# Altium schematic sheet FRAM_memory.SchDoc
size A4; Organization: Creotech Instruments; Address1: Gen. L. Okulickiego 7/9; Address2: 05-500 Piaseczno; Address3: Poland
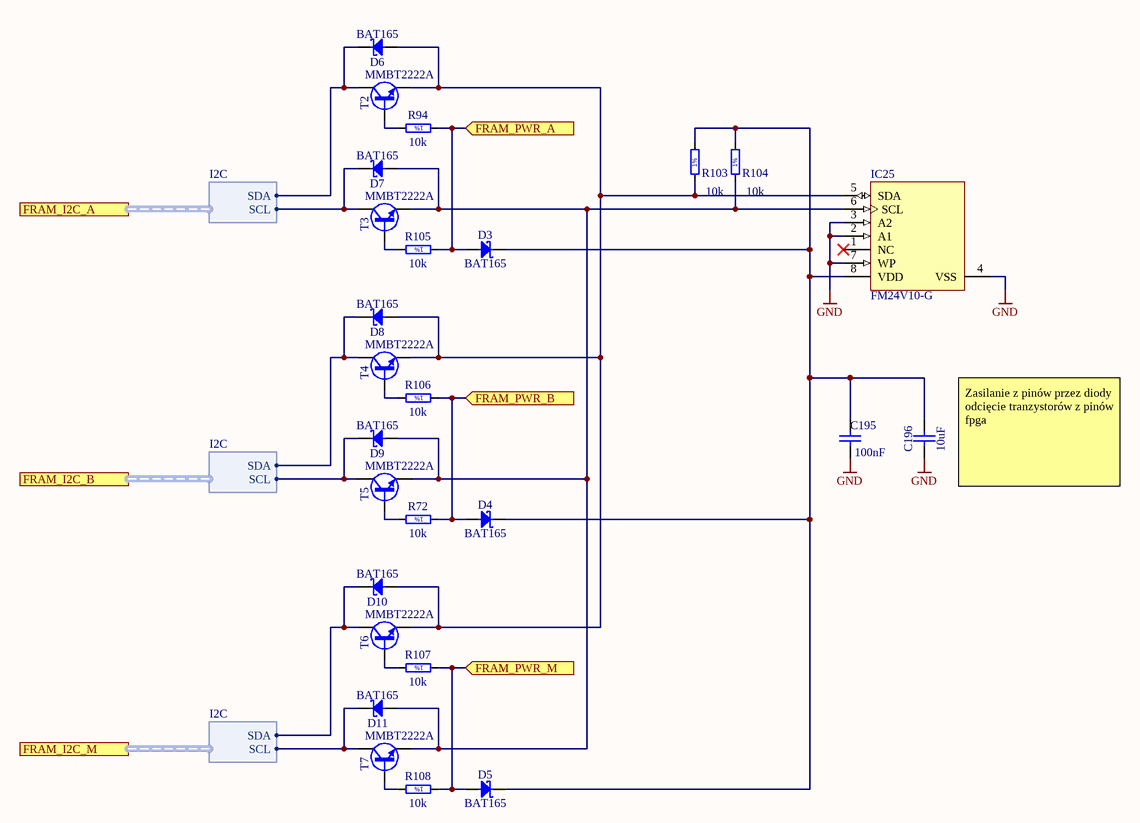
[diagram p0: FRAM_memory.SchDoc]

## Parts
C195  100nF  [CAPC1608X87N]
C196  10uF  [CAPC1608X80N]
D3  BAT165  [SOD2512X110N]
D4  BAT165  [SOD2512X110N]
D5  BAT165  [SOD2512X110N]
D6  BAT165  [SOD2512X110N]
D7  BAT165  [SOD2512X110N]
D8  BAT165  [SOD2512X110N]
D9  BAT165  [SOD2512X110N]
D10  BAT165  [SOD2512X110N]
D11  BAT165  [SOD2512X110N]
IC25  FM24V10-G  [SOIC127P600X175-8N]
R72  10k  [RESC1608X55N]
R94  10k  [RESC1608X55N]
R103  10k  [RESC1608X55N]
R104  10k  [RESC1608X55N]
R105  10k  [RESC1608X55N]
R106  10k  [RESC1608X55N]
R107  10k  [RESC1608X55N]
R108  10k  [RESC1608X55N]
T2  MMBT2222A  [SOT95P240X130-3N]
T3  MMBT2222A  [SOT95P240X130-3N]
T4  MMBT2222A  [SOT95P240X130-3N]
T5  MMBT2222A  [SOT95P240X130-3N]
T6  MMBT2222A  [SOT95P240X130-3N]
T7  MMBT2222A  [SOT95P240X130-3N]

## Ports
FRAM_I2C_A (harness I2C), FRAM_I2C_B (harness I2C), FRAM_I2C_M (harness I2C), FRAM_PWR_A (in), FRAM_PWR_B (in), FRAM_PWR_M (in)

## Harnesses
I2C: SDA, SCL

## Nets
GND: C195.1 C196.1 IC25.2(A1) IC25.3(A2) IC25.4(VSS) IC25.7(WP)
FRAM_PWR_A: D3.2(A) R94.1 R105.1 ; port FRAM_PWR_A
FRAM_PWR_B: D4.2(A) R72.1 R106.1 ; port FRAM_PWR_B
FRAM_PWR_M: D5.2(A) R107.1 R108.1 ; port FRAM_PWR_M
NetC195_2: C195.2 C196.2 D3.1(C) D4.1(C) D5.1(C) IC25.8(VDD) R103.2 R104.2
NetD6_1: D6.1(C) T2.3(C) ; port FRAM_I2C_A.SDA
NetD6_2: D6.2(A) D8.2(A) D10.2(A) IC25.5(SDA) R103.1 T2.2(E) T4.2(E) T6.2(E)
NetD7_1: D7.1(C) T3.3(C) ; port FRAM_I2C_A.SCL
NetD7_2: D7.2(A) D9.2(A) D11.2(A) IC25.6(SCL) R104.1 T3.2(E) T5.2(E) T7.2(E)
NetD8_1: D8.1(C) T4.3(C) ; port FRAM_I2C_B.SDA
NetD9_1: D9.1(C) T5.3(C) ; port FRAM_I2C_B.SCL
NetD10_1: D10.1(C) T6.3(C) ; port FRAM_I2C_M.SDA
NetD11_1: D11.1(C) T7.3(C) ; port FRAM_I2C_M.SCL
NetR72_2: R72.2 T5.1(B)
NetR94_2: R94.2 T2.1(B)
NetR105_2: R105.2 T3.1(B)
NetR106_2: R106.2 T4.1(B)
NetR107_2: R107.2 T6.1(B)
NetR108_2: R108.2 T7.1(B)

Not connected (* = marked no-connect by the designer): IC25 1(NC)*

## Notes on the sheet
- (near C196) Zasilanie z pinów przez diody
  odcięcie tranzystorów z pinów fpga
- Title
- Size:
- Date:
- A4
- Number:
- Time:
- Revision:
- Sheet
- of
- File:
- (in symbol R0603_10K_1%_0.1W_100PPM) 1%

## Library data of the parts
C195 = CC0603_100NF_50V_10%_X7R: Non-polarised capacitor; Part Description: SMD Multilayer Chip Ceramic Capacitor; Manufacturer: GENERIC; Manufacturer1 Part Number: 223858615649; Voltage: 50V; TC: X7R; Tolerance: ±10%; Part Number: CC0603_100NF_50V_10%_X7R; Component Kind: Standard; Component Type: Standard; Pin Count: 2; Value: 100nF; Status: Preferred; Manufacturer Part Number: CC0603_100NF_50V_10%_X7R; Case: 0603; Mounted: Yes; Socket: No; SMD: Yes; Sense: No; Manufacturer1 Example: PHYCOMP; Manufacturer1 ComponentHeight: 0.87mm; HelpURL: \\cern.ch\dfs\Applications\Altium\Datasheets\CC0603_X7R_PHYCOMP.pdf; Author: CERN DEM JLC; CreateDate: 2007-12-03; LatestRevisionDate: 2007-12-03
C196 = CC0603_10UF_16V_20%_X5R: Non-polarised capacitor; Part Description: SMD Multilayer Chip Ceramic Capacitor; Manufacturer: GENERIC; Manufacturer1 Part Number: GRM188R61C106MA73D; Voltage: 16V; TC: X5R; Tolerance: ±20%; Part Number: CC0603_10UF_16V_20%_X5R; Component Kind: Standard; Component Type: Standard; Pin Count: 2; Value: 10uF; Status: None; Manufacturer Part Number: CC0603_10UF_16V_20%_X5R; Case: 0603; Mounted: Yes; Socket: No; SMD: Yes; Sense: No; Manufacturer1 Example: MURATA; Manufacturer1 ComponentHeight: 0.8mm; HelpURL: \\cern.ch\dfs\Applications\Altium\Datasheets\CC0603_X5R_MURATA_GRM.pdf; Author: CERN DEM MR; CreateDate: 02.03.2016; LatestRevisionDate: 02.03.2016
D3-D11 = BAT165: Schottky Diode; Part Description: Medium Power AF Schottky Diode; Manufacturer: INFINEON; Voltage: 40V; Power: 750mA; PressFit: No; Bonding: No; Part Number: BAT165; Component Kind: Standard; Component Type: Standard; Device: BAT165; PackageDescription: Small Outline Diode Flat Lead (SOD-323), 1.70mm W X 1.25mm L X 1.10mm H body,  IPC Medium Density; Manufacturer Part Number: BAT165; Pin Count: 2; Case: SOD323; Mounted: Yes; Socket: No; SMD: Yes; Sense: No; ComponentHeight: 1.1mm; HelpURL: \\cern.ch\dfs\Applications\Altium\Datasheets\BAT165.pdf; Author: CERN DEM JLC; CreateDate: 2014-11-12; LatestRevisionDate: 2014-11-12
IC25 = MEM_FM24V10-G: Manufacturer: Cypress; Part Description: 1Mbit I2C FRAM; Bonding: No; PressFit: No; Case: *; Component Kind: Standard; Component Type: Standard; ComponentHeigth: *; CreateDate: 2018-01-01; Device: FM24V10-G; Footprint: *; HelpURL: *; LatestRevisionDate: 2018-01-01; Manufacturer Part Number: FM24V10-G; Mounted: Yes; PackageDescription: SO8; Part Number: FM24V10-G; Pin Count: 8; Sense: No; SMD: Yes; Socket: No; Value: *
R72 R94 R103-R108 = R0603_10K_1%_0.1W_100PPM: Resistor - 1%; Part Description: General Purpose Thick Film Chip Resistor; Manufacturer: GENERIC; Manufacturer1 Part Number: NRC06F1002TRF; Power: 0.1W; TC: ±100ppm/°C; PressFit: No; Part Number: R0603_10K_1%_0.1W_100PPM; Component Kind: Standard; Component Type: Standard; Pin Count: 2; Value: 10k; Status: Preferred; Tolerance: ±1%; Manufacturer Part Number: R0603_10K_1%_0.1W_100PPM; Case: 0603; Mounted: Yes; Sense: No; Socket: No; SMD: Yes; Manufacturer1 Example: NIC COMPONENT; Manufacturer1 ComponentHeight: 0.55mm; HelpURL: \\cern.ch\dfs\Applications\Altium\Datasheets\R0603_NIC_NRC.pdf; Author: CERN DEM JLC; CreateDate: 2007-12-03; LatestRevisionDate: 2008-03-13
T2-T7 = MMBT2222A: NPN Transistor; Part Description: 40V 1A NPN General Purpose Amplifier; Manufacturer: FAIRCHILD SEMICONDUCTOR; PressFit: No; Bonding: No; Part Number: MMBT2222A; Component Kind: Standard; Component Type: Standard; Device: MMBT2222A; PackageDescription: SOT23 3-Leads, Pitch 0.95mm - Body 1.4x3mm, IPC Medium Density; Manufacturer Part Number: MMBT2222A; Pin Count: 3; Case: SOT23-3; Mounted: Yes; Socket: No; SMD: Yes; Sense: No; ComponentHeight: 1.3mm; HelpURL: \\cern.ch\dfs\Applications\Altium\Datasheets\MJD45H11G.pdf; Author: CERN DEM JLC; CreateDate: 2009-05-04; LatestRevisionDate: 2009-05-04